# EAGLE design schematic (EAGLE 7.7.0)
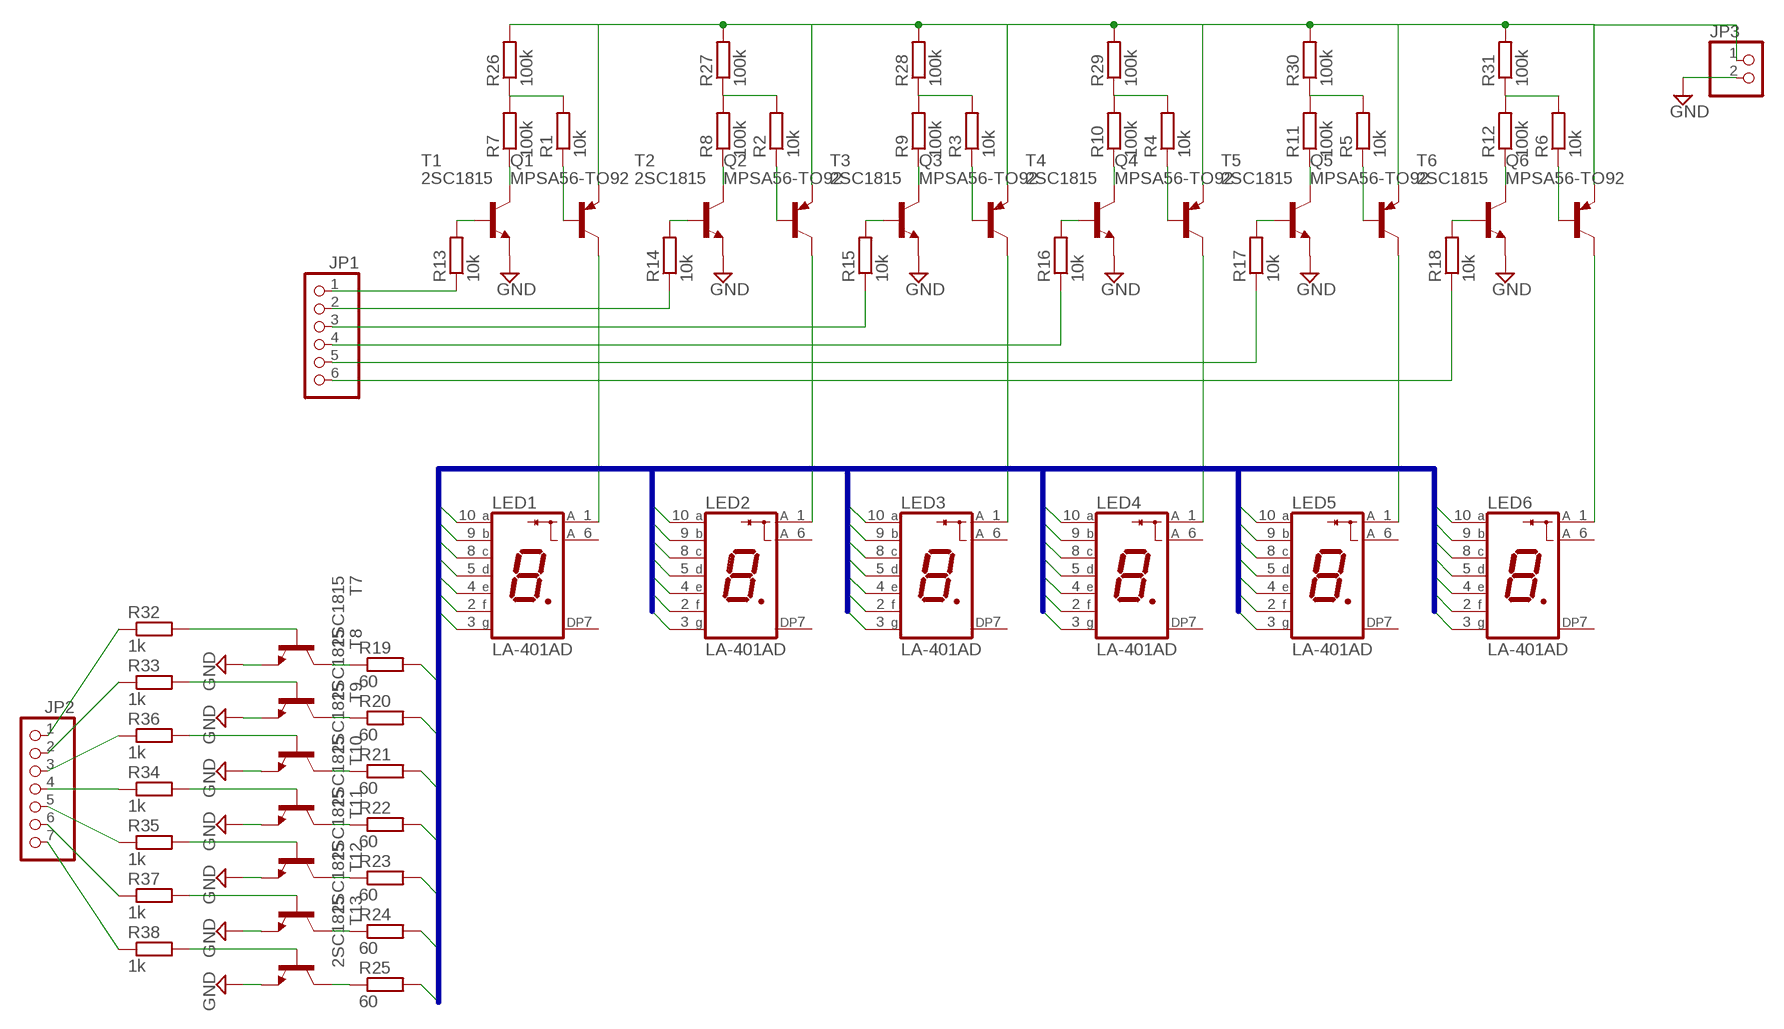
[diagram p0: schematic, sheet 1]

## Parts
JP1  PINHD-1X6  [1X06]
JP2  PINHD-1X7  [1X07]
JP3  PINHD-1X2  [1X02]
LED1  LA-401AD  [LA-401]
LED2  LA-401AD  [LA-401]
LED3  LA-401AD  [LA-401]
LED4  LA-401AD  [LA-401]
LED5  LA-401AD  [LA-401]
LED6  LA-401AD  [LA-401]
Q1  MPSA56-TO92  [TO92-CBE]
Q2  MPSA56-TO92  [TO92-CBE]
Q3  MPSA56-TO92  [TO92-CBE]
Q4  MPSA56-TO92  [TO92-CBE]
Q5  MPSA56-TO92  [TO92-CBE]
Q6  MPSA56-TO92  [TO92-CBE]
R1  10k  R-EU_0204/5  [0204/5]
R2  10k  R-EU_0204/5  [0204/5]
R3  10k  R-EU_0204/5  [0204/5]
R4  10k  R-EU_0204/5  [0204/5]
R5  10k  R-EU_0204/5  [0204/5]
R6  10k  R-EU_0204/5  [0204/5]
R7  100k  R-EU_0204/5  [0204/5]
R8  100k  R-EU_0204/5  [0204/5]
R9  100k  R-EU_0204/5  [0204/5]
R10  100k  R-EU_0204/5  [0204/5]
R11  100k  R-EU_0204/5  [0204/5]
R12  100k  R-EU_0204/5  [0204/5]
R13  10k  R-EU_0204/5  [0204/5]
R14  10k  R-EU_0204/5  [0204/5]
R15  10k  R-EU_0204/5  [0204/5]
R16  10k  R-EU_0204/5  [0204/5]
R17  10k  R-EU_0204/5  [0204/5]
R18  10k  R-EU_0204/5  [0204/5]
R19  60  R-EU_0204/5  [0204/5]
R20  60  R-EU_0204/5  [0204/5]
R21  60  R-EU_0204/5  [0204/5]
R22  60  R-EU_0204/5  [0204/5]
R23  60  R-EU_0204/5  [0204/5]
R24  60  R-EU_0204/5  [0204/5]
R25  60  R-EU_0204/5  [0204/5]
R26  100k  R-EU_0204/5  [0204/5]
R27  100k  R-EU_0204/5  [0204/5]
R28  100k  R-EU_0204/5  [0204/5]
R29  100k  R-EU_0204/5  [0204/5]
R30  100k  R-EU_0204/5  [0204/5]
R31  100k  R-EU_0204/5  [0204/5]
R32  1k  R-EU_0204/5  [0204/5]
R33  1k  R-EU_0204/5  [0204/5]
R34  1k  R-EU_0204/5  [0204/5]
R35  1k  R-EU_0204/5  [0204/5]
R36  1k  R-EU_0204/5  [0204/5]
R37  1k  R-EU_0204/5  [0204/5]
R38  1k  R-EU_0204/5  [0204/5]
T1  2SC1815  [TO92-ECB]
T2  2SC1815  [TO92-ECB]
T3  2SC1815  [TO92-ECB]
T4  2SC1815  [TO92-ECB]
T5  2SC1815  [TO92-ECB]
T6  2SC1815  [TO92-ECB]
T7  2SC1815  [TO92-ECB]
T8  2SC1815  [TO92-ECB]
T9  2SC1815  [TO92-ECB]
T10  2SC1815  [TO92-ECB]
T11  2SC1815  [TO92-ECB]
T12  2SC1815  [TO92-ECB]
T13  2SC1815  [TO92-ECB]

## Nets
GND: JP3.2 T1.E T2.E T3.E T4.E T5.E T6.E T7.E T8.E T9.E T10.E T11.E T12.E T13.E
N$1: R2.2 R8.2 R27.1
N$2: Q2.B R2.1
N$3: Q4.B R4.1
N$4: R5.2 R11.2 R30.1
N$5: Q5.B R5.1
N$6: Q6.B R6.1
N$7: JP3.1 Q1.E Q2.E Q3.E Q4.E Q5.E Q6.E R26.2 R27.2 R28.2 R29.2 R30.2 R31.2
N$8: R13.2 T1.B
N$9: Q1.B R1.1
N$10: R3.2 R9.2 R28.1
N$11: R14.2 T2.B
N$12: R15.2 T3.B
N$13: Q3.B R3.1
N$14: R16.2 T4.B
N$15: LED1.1(A) Q1.C
N$16: R17.2 T5.B
N$17: LED2.1(A) Q2.C
N$18: LED3.1(A) Q3.C
N$19: R18.2 T6.B
N$20: LED4.1(A) Q4.C
N$21: R1.2 R7.2 R26.1
N$22: LED5.1(A) Q5.C
N$23: LED6.1(A) Q6.C
N$24: R4.2 R10.2 R29.1
N$25: R6.2 R12.2 R31.1
N$26: R19.1 T7.C
N$27: R25.1 T13.C
N$28: R24.1 T12.C
N$29: R23.1 T11.C
N$30: R22.1 T10.C
N$31: R21.1 T9.C
N$32: R7.1 T1.C
N$33: R8.1 T2.C
N$34: R9.1 T3.C
N$35: R12.1 T6.C
N$36: R11.1 T5.C
N$37: R10.1 T4.C
N$38: R20.1 T8.C
N$39: R32.2 T7.B
N$40: R33.2 T8.B
N$41: R36.2 T9.B
N$42: R34.2 T10.B
N$43: R35.2 T11.B
N$44: R37.2 T12.B
N$45: R38.2 T13.B
N$46: JP2.1 R32.1
N$47: JP2.2 R33.1
N$48: JP2.3 R36.1
N$49: JP2.4 R34.1
N$50: JP2.5 R35.1
N$51: JP2.6 R37.1
N$52: JP2.7 R38.1
N$53: JP1.1 R13.1
N$54: JP1.2 R14.1
N$55: JP1.3 R15.1
N$56: JP1.4 R16.1
N$57: JP1.5 R17.1
N$58: JP1.6 R18.1
SEGMENT1: LED1.3(G) LED2.3(G) LED3.3(G) LED4.3(G) LED5.3(G) LED6.3(G) R25.2
SEGMENT2: LED1.2(F) LED2.2(F) LED3.2(F) LED4.2(F) LED5.2(F) LED6.2(F) R24.2
SEGMENT3: LED1.4(E) LED2.4(E) LED3.4(E) LED4.4(E) LED5.4(E) LED6.4(E) R23.2
SEGMENT4: LED1.5(D) LED2.5(D) LED3.5(D) LED4.5(D) LED5.5(D) LED6.5(D) R22.2
SEGMENT5: LED1.8(C) LED2.8(C) LED3.8(C) LED4.8(C) LED5.8(C) LED6.8(C) R21.2
SEGMENT6: LED1.9(B) LED2.9(B) LED3.9(B) LED4.9(B) LED5.9(B) LED6.9(B) R20.2
SEGMENT7: LED1.10(A) LED2.10(A) LED3.10(A) LED4.10(A) LED5.10(A) LED6.10(A) R19.2
Unconnected: LED1.6(A) LED1.7(DP) LED2.6(A) LED2.7(DP) LED3.6(A) LED3.7(DP) LED4.6(A) LED4.7(DP) LED5.6(A) LED5.7(DP) LED6.6(A) LED6.7(DP)

## Buses
SEGMENT[1..7]

## Library data of the parts
JP1 = pinhead:PINHD-1X6: PIN HEADER
JP2 = pinhead:PINHD-1X7: PIN HEADER
JP3 = pinhead:PINHD-1X2: PIN HEADER
LED1-LED6 = led-7-segment:LA-401*D: Single Digit LED Numeric Display (anode common) Source: ROHM .. la-1401dn.pdf; OC_FARNELL: unknown; OC_NEWARK: unknown
Q1-Q6 = transistor-pnp:*-?: PNP Transistor
R1-R38 = resistor:R-EU_: RESISTOR, European symbol
T1-T13 = transistor:2SC1815: NPN EPITAXIAL TRANSISTOR Source: TOSHIBA .. 2SC1815 1.pdf

## Board
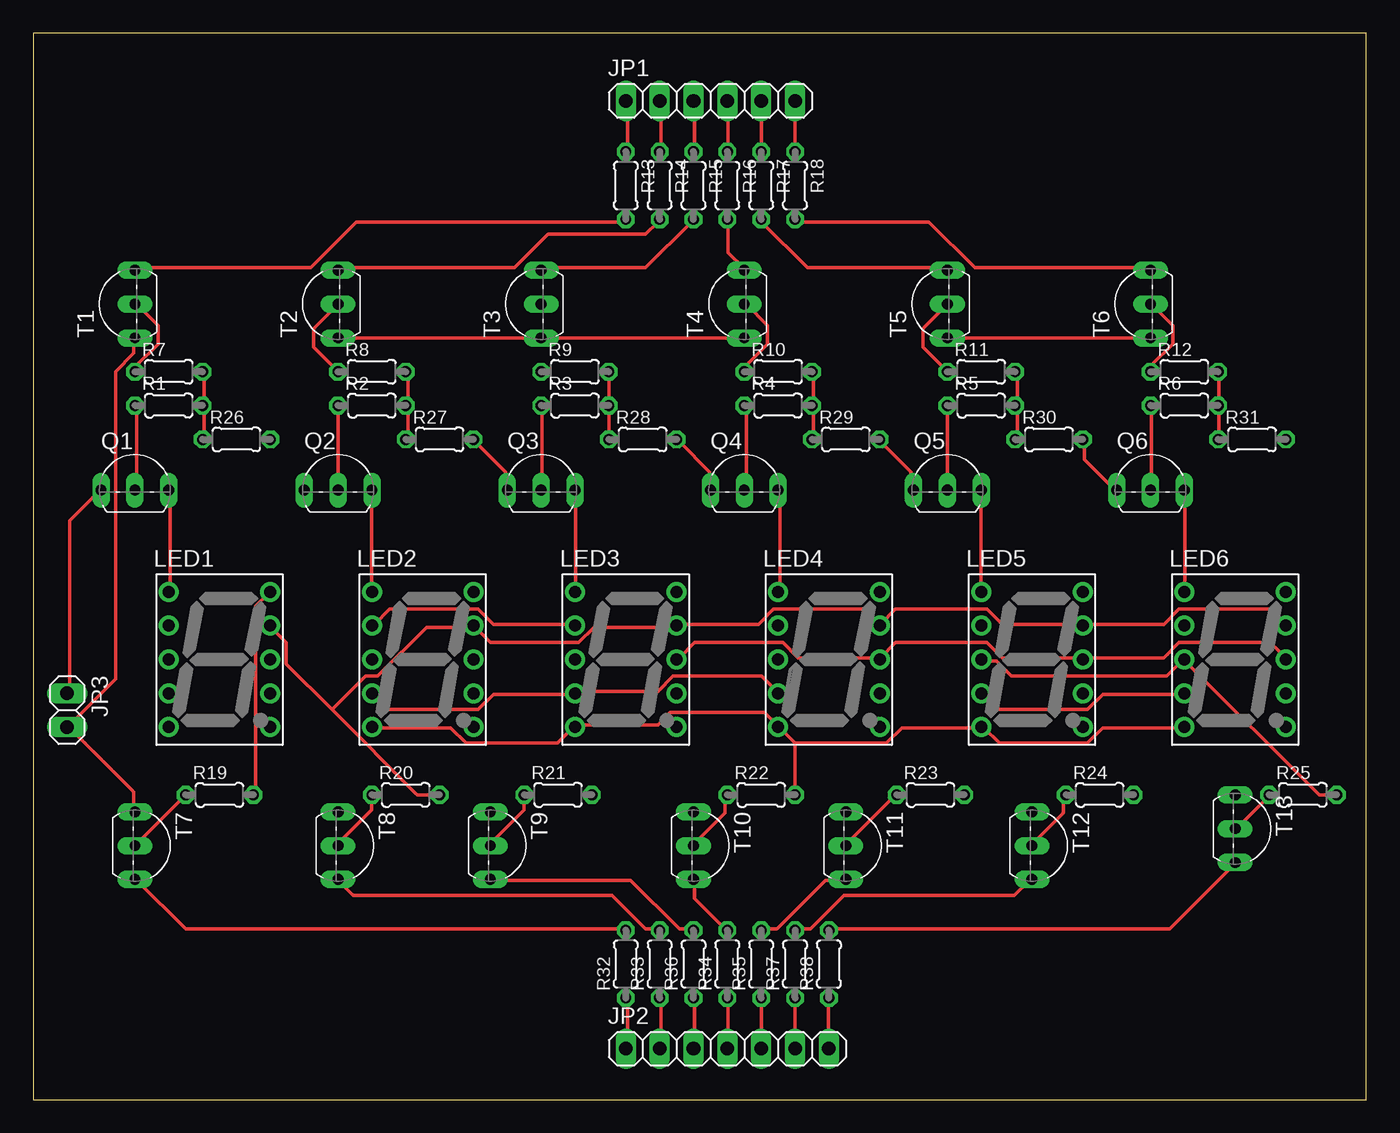
[diagram p1: board, top side]
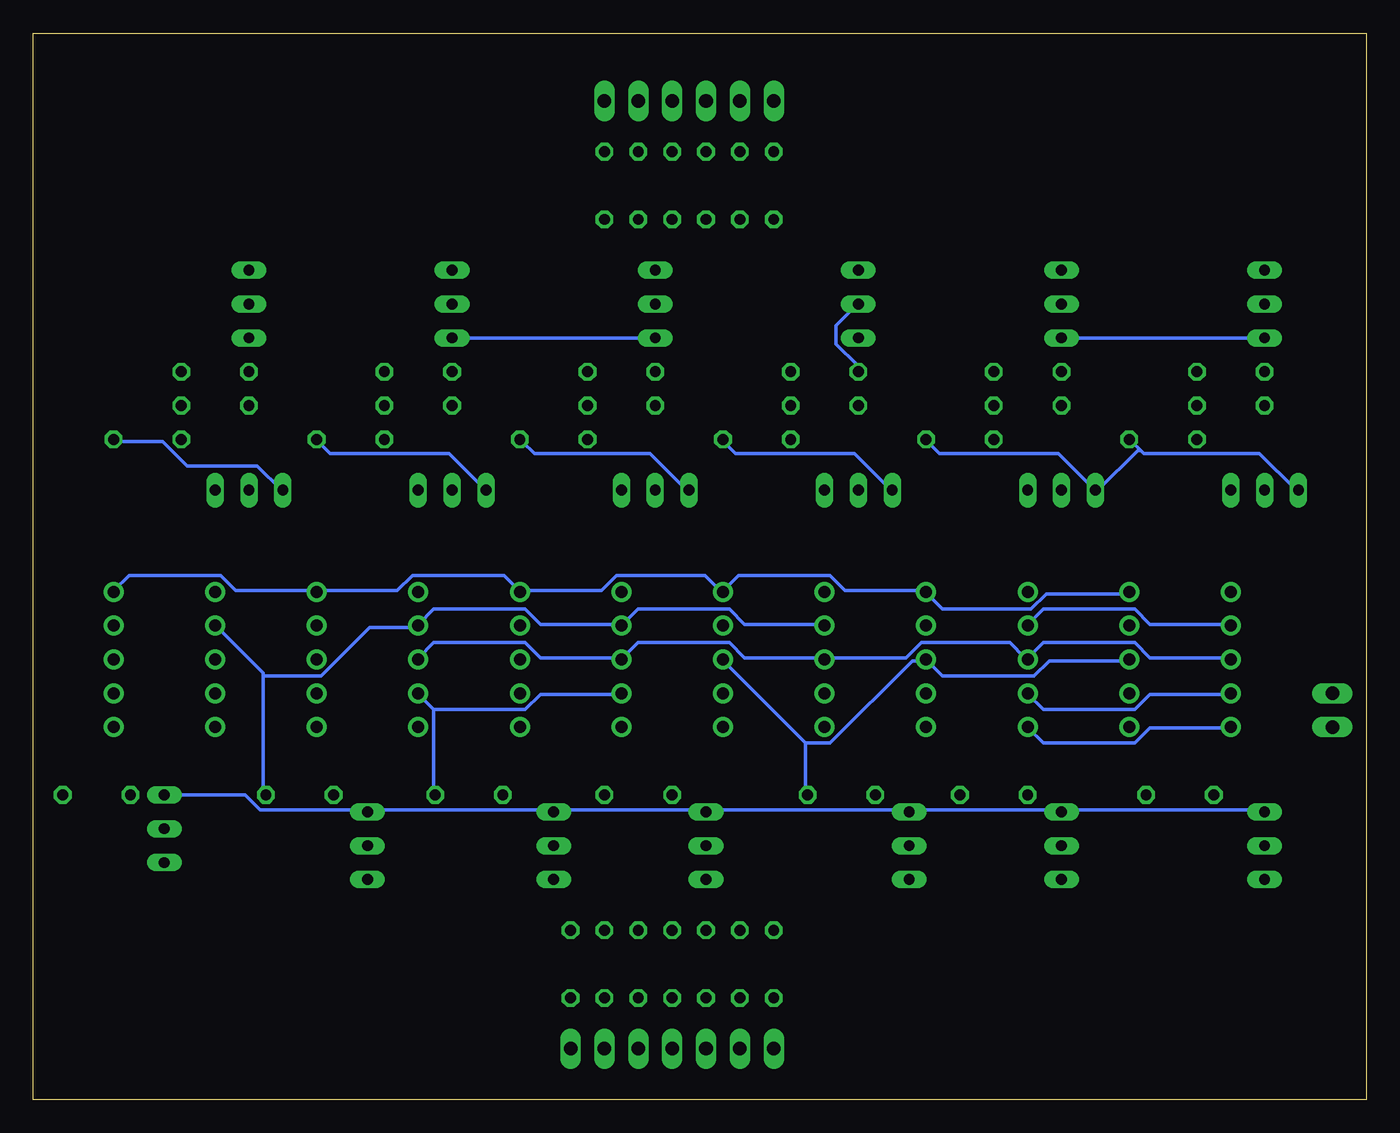
[diagram p2: board, bottom side, seen from below]

Size 100 x 80 mm. Coordinates in mm from the lower left corner, seen from the top.
Outline: 0,0 100,0 100,80 0,80 0,0
Copper layers (1*16): Top 0.035mm / dielectric 1.5mm / Bottom 0.035mm
Design rules "default": minimum track width 10mil, minimum drill 24mil, track to track 8mil, track to pad 8mil, pad to pad 8mil, via to via 8mil, smd to smd 8mil, copper to edge 40mil, drill to drill 8mil, minimum pad ring 10mil, minimum via ring 8mil, stop-mask expansion 4mil, vias tented up to drill 0mil, thermal gap 10mil

### Footprints (pad centres in the part's own frame; a part is rotated, then mirrored left to right if it is on the bottom)
1X06 = drill 1.016 long: 1 -6.35,0; 2 -3.81,0; 3 -1.27,0; 4 1.27,0; 5 3.81,0; 6 6.35,0
1X07 = drill 1.016 long: 1 -7.62,0; 2 -5.08,0; 3 -2.54,0; 4 0,0; 5 2.54,0; 6 5.08,0; 7 7.62,0
1X02 = drill 1.016 long: 1 -1.27,0; 2 1.27,0
LA-401 = drill 0.9 pad 1.5: 1 -3.81,5.08; 2 -3.81,2.54; 3 -3.81,0; 4 -3.81,-2.54; 5 -3.81,-5.08; 6 3.81,-5.08; 7 3.81,-2.54; 8 3.81,0; 9 3.81,2.54; 10 3.81,5.08
TO92-CBE = drill 0.813 long: B 0,0; C 2.54,0; E -2.54,0
0204/5 = drill 0.813 octagon: 1 -2.54,0; 2 2.54,0
TO92-ECB = drill 0.813 long: B 2.54,0; C 0,0; E -2.54,0

### Placement (x,y rotation side)
JP1  50.8,74.93 0 top
JP2  52.07,3.81 0 top
JP3  2.54,29.21 270 top
LED1  13.97,33.02 0 top
LED2  29.21,33.02 0 top
LED3  44.45,33.02 0 top
LED4  59.69,33.02 0 top
LED5  74.93,33.02 0 top
LED6  90.17,33.02 0 top
Q1  7.62,45.72 0 top
Q2  22.86,45.72 0 top
Q3  38.1,45.72 0 top
Q4  53.34,45.72 0 top
Q5  68.58,45.72 0 top
Q6  83.82,45.72 0 top
R1  10.16,52.07 0 top
R2  25.4,52.07 0 top
R3  40.64,52.07 0 top
R4  55.88,52.07 0 top
R5  71.12,52.07 0 top
R6  86.36,52.07 0 top
R7  10.16,54.61 0 top
R8  25.4,54.61 0 top
R9  40.64,54.61 0 top
R10  55.88,54.61 0 top
R11  71.12,54.61 0 top
R12  86.36,54.61 0 top
R13  44.45,68.58 270 top
R14  46.99,68.58 270 top
R15  49.53,68.58 270 top
R16  52.07,68.58 270 top
R17  54.61,68.58 270 top
R18  57.15,68.58 270 top
R19  13.97,22.86 0 top
R20  27.94,22.86 0 top
R21  39.37,22.86 0 top
R22  54.61,22.86 0 top
R23  67.31,22.86 0 top
R24  80.01,22.86 0 top
R25  95.25,22.86 0 top
R26  15.24,49.53 0 top
R27  30.48,49.53 0 top
R28  45.72,49.53 0 top
R29  60.96,49.53 0 top
R30  76.2,49.53 0 top
R31  91.44,49.53 0 top
R32  44.45,10.16 90 top
R33  46.99,10.16 90 top
R34  52.07,10.16 90 top
R35  54.61,10.16 90 top
R36  49.53,10.16 90 top
R37  57.15,10.16 90 top
R38  59.69,10.16 90 top
T1  7.62,59.69 90 top
T2  22.86,59.69 90 top
T3  38.1,59.69 90 top
T4  53.34,59.69 90 top
T5  68.58,59.69 90 top
T6  83.82,59.69 90 top
T7  7.62,19.05 270 top
T8  22.86,19.05 270 top
T9  34.29,19.05 270 top
T10  49.53,19.05 270 top
T11  60.96,19.05 270 top
T12  74.93,19.05 270 top
T13  90.17,20.32 270 top

### Tracks (layer width: path | path; a pad name or v marks a point on that pad's centre or on a via)
GND
  Top 0.254: T6.E T5.E | T4.E T3.E T2.E | T7.E 7.54,21.72 7.54,23.09 2.74,27.89 JP3.2 2.74,28.12 6.17,31.55 6.17,54.63 7.54,56.01 7.54,57.15 T1.E
  Bottom 0.254: T2.E T1.E | T4.E T5.E | 34.29,21.72 22.86,21.72 | 22.86,21.72 7.77,21.72 T7.E | 22.86,21.72 T8.E | T13.E 84.12,22.86 82.98,21.72 74.98,21.72 T12.E 74.75,21.72 61.04,21.72 T11.E 60.81,21.72 49.61,21.72 T10.E 49.38,21.72 34.29,21.72 | 34.29,21.72 T9.E
N$1
  Top 0.254: R27.1 28.12,49.61 28.12,51.89 R2.2 28.12,52.12 28.12,54.41 R8.2
N$2
  Top 0.254: R2.1 Q2.B
N$3
  Top 0.254: Q4.B 53.49,45.72 53.49,51.89 R4.1
N$4
  Top 0.254: R30.1 73.84,49.61 73.84,51.89 R5.2 73.84,52.12 73.84,54.41 R11.2
N$5
  Top 0.254: R5.1 Q5.B
N$6
  Top 0.254: Q6.B 83.9,45.72 83.9,51.89 R6.1
N$7
  Top 0.254: JP3.1 2.74,30.63 2.74,43.43 5.03,45.72 Q1.E | Q3.E 35.43,45.72 35.43,47.09 33.15,49.38 R27.2 | Q4.E 50.75,45.72 50.75,47.09 48.46,49.38 R28.2 | Q5.E 65.84,45.72 65.84,47.09 63.55,49.38 R29.2 | R30.2 78.87,49.38 78.87,48.01 81.15,45.72 Q6.E
  Bottom 0.254: 16.92,48.69 17.6,49.38 R26.2 | 16.92,48.69 16.69,48.46 8,48.46 5.26,45.72 Q1.E | 16.92,48.69 17.14,48.69 20.12,45.72 Q2.E 20.34,45.72 23.09,48.46 32,48.46 32.92,49.38 R27.2 | Q3.E 35.66,45.72 38.41,48.46 47.32,48.46 48.23,49.38 R28.2 | R31.2 93.95,49.38 90.3,49.38 88.47,47.55 83.21,47.55 81.38,45.72 Q6.E | Q5.E 66.06,45.72 68.81,48.46 77.72,48.46 78.64,49.38 R30.2 | Q4.E 50.98,45.72 53.72,48.46 62.41,48.46 63.32,49.38 R29.2
N$8
  Top 0.254: T1.B 7.77,62.41 20.8,62.41 24.23,65.84 44.35,65.84 R13.2
N$9
  Top 0.254: Q1.B 7.77,45.72 7.77,51.89 R1.1
N$10
  Top 0.254: R28.1 43.2,49.61 43.2,51.89 R3.2 43.2,52.12 43.2,54.41 R9.2
N$11
  Top 0.254: T2.B 22.86,62.41 36.12,62.41 38.63,64.92 45.95,64.92 46.86,65.84 R14.2
N$12
  Top 0.254: T3.B 38.18,62.41 45.95,62.41 49.38,65.84 R15.2
N$13
  Top 0.254: Q3.B 38.18,45.72 38.18,51.89 R3.1
N$14
  Top 0.254: R16.2 52.12,65.84 52.12,63.55 53.26,62.41 T4.B
N$15
  Top 0.254: Q1.C 10.29,45.72 10.29,38.18 LED1.1
N$16
  Top 0.254: T5.B 68.58,62.41 58.06,62.41 54.63,65.84 R17.2
N$17
  Top 0.254: Q2.C 25.38,45.72 25.38,38.18 LED2.1
N$18
  Top 0.254: Q3.C 40.69,45.72 40.69,38.18 LED3.1
N$19
  Top 0.254: T6.B 83.67,62.41 70.64,62.41 67.21,65.84 57.15,65.84 R18.2
N$20
  Top 0.254: Q4.C 56.01,45.72 56.01,38.18 LED4.1
N$21
  Top 0.254: R26.1 12.8,49.61 12.8,51.89 R1.2 12.8,52.12 12.8,54.41 R7.2
N$22
  Top 0.254: Q5.C 71.09,45.72 71.09,38.18 LED5.1
N$23
  Top 0.254: Q6.C 86.41,45.72 86.41,38.18 LED6.1
N$24
  Top 0.254: R29.1 58.52,49.61 58.52,51.89 R4.2 58.52,52.12 58.52,54.41 R10.2
N$25
  Top 0.254: R31.1 88.92,49.61 88.92,51.89 R6.2 88.92,52.12 88.92,54.41 R12.2
N$26
  Top 0.254: R19.1 T7.C
N$27
  Top 0.254: T13.C 90.3,20.34 92.81,22.86 R25.1
N$28
  Top 0.254: T12.C 74.98,19.2 77.27,21.49 77.27,22.86 R24.1
N$29
  Top 0.254: T11.C 61.04,19.2 64.69,22.86 R23.1
N$30
  Top 0.254: T10.C 49.61,19.2 51.89,21.49 51.89,22.86 R22.1
N$31
  Top 0.254: T9.C 34.29,19.2 36.8,21.72 36.8,22.86 R21.1
N$32
  Top 0.254: R7.1 7.77,54.63 7.77,55.09 9.37,56.69 9.37,58.06 7.77,59.66 T1.C
N$33
  Top 0.254: R8.1 22.86,54.63 21.03,56.46 21.03,57.84 22.86,59.66 T2.C
N$34
  Bottom 0.254: R9.1 38.18,54.63 38.18,55.09 39.78,56.69 39.78,58.06 38.18,59.66 T3.C
N$35
  Top 0.254: R12.1 83.9,54.63 83.9,55.09 85.5,56.69 85.5,58.06 83.9,59.66 T6.C
N$36
  Top 0.254: R11.1 68.58,54.63 66.75,56.46 66.75,57.84 68.58,59.66 T5.C
N$37
  Top 0.254: R10.1 53.49,54.63 53.49,55.09 55.09,56.69 55.09,58.06 53.49,59.66 T4.C
N$38
  Top 0.254: T8.C 22.86,19.2 25.38,21.72 25.38,22.86 R20.1
N$39
  Top 0.254: R32.2 44.35,12.8 11.43,12.8 7.77,16.46 T7.B
N$40
  Top 0.254: R33.2 46.86,12.8 45.95,12.8 43.43,15.32 24,15.32 22.86,16.46 T8.B
N$41
  Top 0.254: R36.2 49.38,12.8 48.46,12.8 44.81,16.46 34.29,16.46 T9.B
N$42
  Top 0.254: T10.B 49.61,16.46 49.61,15.09 51.89,12.8 R34.2
N$43
  Top 0.254: R35.2 54.63,12.8 55.78,12.8 59.44,16.46 60.81,16.46 T11.B
N$44
  Top 0.254: R37.2 57.15,12.8 58.29,12.8 60.81,15.32 73.61,15.32 74.75,16.46 T12.B
N$45
  Top 0.254: R38.2 59.89,12.8 85.27,12.8 90.07,17.6 T13.B
N$46
  Top 0.254: R32.1 44.58,7.54 44.58,3.89 JP2.1
N$47
  Top 0.254: R33.1 47.09,7.54 47.09,3.89 JP2.2
N$48
  Top 0.254: R36.1 49.61,7.54 49.61,3.89 JP2.3
N$49
  Top 0.254: R34.1 52.12,7.54 52.12,3.89 JP2.4
N$50
  Top 0.254: R35.1 54.63,7.54 54.63,3.89 JP2.5
N$51
  Top 0.254: JP2.6 R37.1
N$52
  Top 0.254: R38.1 59.66,7.54 59.66,3.89 JP2.7
N$53
  Top 0.254: R13.1 44.58,71.32 44.58,74.75 JP1.1
N$54
  Top 0.254: R14.1 47.09,71.32 47.09,74.75 JP1.2
N$55
  Top 0.254: R15.1 49.61,71.32 49.61,74.75 JP1.3
N$56
  Top 0.254: R16.1 52.12,71.32 52.12,74.75 JP1.4
N$57
  Top 0.254: R17.1 54.63,71.32 54.63,74.75 JP1.5
N$58
  Top 0.254: JP1.6 R18.1
SEGMENT1
  Top 0.254: R25.2 96.47,22.86 86.41,32.92 LED6.3 86.18,32.92 85.04,31.77 73.38,31.77 72.24,32.92 71.32,32.92 LED5.3
  Bottom 0.254: LED1.3 10.29,33.15 16.23,33.15 17.37,34.29 24.23,34.29 25.38,33.15 LED2.3 25.6,33.15 26.75,34.29 33.38,34.29 34.52,33.15 40.46,33.15 LED3.3 40.69,33.15 46.63,33.15 47.78,34.29 54.63,34.29 55.78,33.15 LED4.3 56.01,33.15 61.95,33.15 63.09,34.29 69.95,34.29 71.09,33.15 LED5.3
SEGMENT2
  Top 0.254: LED3.2 40.46,35.66 34.52,35.66 33.38,36.8 26.75,36.8 25.6,35.66 LED2.2
  Bottom 0.254: LED1.2 10.29,35.66 16.23,35.66 17.37,36.8 24.23,36.8 25.38,35.66 LED2.2 | 82.75,31.77 82.75,32 86.18,35.43 LED6.2 | 82.75,31.77 82.75,22.86 R24.2 | 82.75,31.77 78.41,31.77 74.75,35.43 71.32,35.43 LED5.2 71.09,35.66 69.95,36.8 63.09,36.8 61.95,35.66 56.01,35.66 LED4.2 54.63,36.8 47.78,36.8 46.63,35.66 40.69,35.66 LED3.2
SEGMENT3
  Top 0.254: LED2.4 25.6,30.4 26.75,29.26 33.38,29.26 34.52,30.4 40.46,30.4 LED3.4 40.69,30.63 46.86,30.63 48.01,31.77 54.63,31.77 55.78,30.63 LED4.4 | LED6.4 86.18,30.4 80.24,30.4 79.1,29.26 72.47,29.26 71.32,30.4 LED5.4
  Bottom 0.254: LED1.4 10.29,30.4 16.23,30.4 17.37,29.26 24.23,29.26 25.38,30.4 LED2.4 | 69.95,29.26 69.95,22.86 R23.2 | 69.95,29.26 71.09,30.4 LED5.4 | 69.95,29.26 63.09,29.26 61.95,30.4 56.01,30.4 LED4.4
SEGMENT4
  Top 0.254: 57.15,26.75 R22.2 | 57.15,26.75 56.01,27.89 LED4.5 55.78,28.12 54.86,29.03 47.78,29.03 46.86,28.12 40.69,28.12 LED3.5 40.46,27.89 39.32,26.75 32.46,26.75 31.32,27.89 25.6,27.89 LED2.5 | 57.15,26.75 64.01,26.75 65.15,27.89 71.09,27.89 LED5.5 71.32,27.89 72.47,26.75 79.1,26.75 80.24,27.89 86.18,27.89 LED6.5
  Bottom 0.254: LED1.5 10.29,27.89 16.23,27.89 17.37,26.75 24.23,26.75 25.38,27.89 LED2.5
SEGMENT5
  Top 0.254: LED6.8 93.95,33.15 92.81,34.29 85.95,34.29 84.81,33.15 78.87,33.15 LED5.8 78.64,33.15 72.69,33.15 71.55,34.29 64.69,34.29 63.55,33.15 LED4.8 63.32,33.15 57.38,33.15 56.24,34.29 49.61,34.29 48.46,33.15 LED3.8
  Bottom 0.254: LED1.8 17.83,32.92 23.77,32.92 24.92,31.77 31.77,31.77 LED2.8 33.15,32.92 34.06,32.92 40.23,26.75 42.06,26.75 | 42.06,26.75 42.06,22.86 R21.2 | 42.06,26.75 48.23,32.92 LED3.8
SEGMENT6
  Top 0.254: LED6.9 93.95,35.66 92.81,36.8 85.95,36.8 84.81,35.66 78.87,35.66 LED5.9 78.64,35.66 72.69,35.66 71.55,36.8 64.69,36.8 63.55,35.66 LED4.9 63.32,35.66 62.18,36.8 55.55,36.8 54.41,35.66 48.46,35.66 LED3.9 48.23,35.43 42.06,35.43 40.92,34.29 34.29,34.29 LED2.9 32.92,35.43 29.49,35.43 25.83,31.77 24.92,31.77 22.4,29.26 | R20.2 28.8,22.86 22.4,29.26 | 22.4,29.26 18.97,32.69 18.97,34.29 17.83,35.43 LED1.9
SEGMENT7
  Top 0.254: R19.2 16.69,22.86 16.69,37.03 17.6,37.95 LED1.10
  Bottom 0.254: LED6.10 93.95,38.18 92.81,39.32 85.95,39.32 84.81,38.18 78.87,38.18 LED5.10 78.64,38.18 72.69,38.18 71.55,39.32 64.69,39.32 63.55,38.18 LED4.10 63.32,38.18 57.38,38.18 56.24,39.32 49.61,39.32 48.46,38.18 LED3.10 48.23,38.18 47.09,39.32 40.23,39.32 39.09,38.18 33.15,38.18 LED2.10 32.92,37.95 31.77,36.8 25.15,36.8 24,37.95 17.83,37.95 LED1.10